# EAGLE design H00R80 (EAGLE 9.3.0)
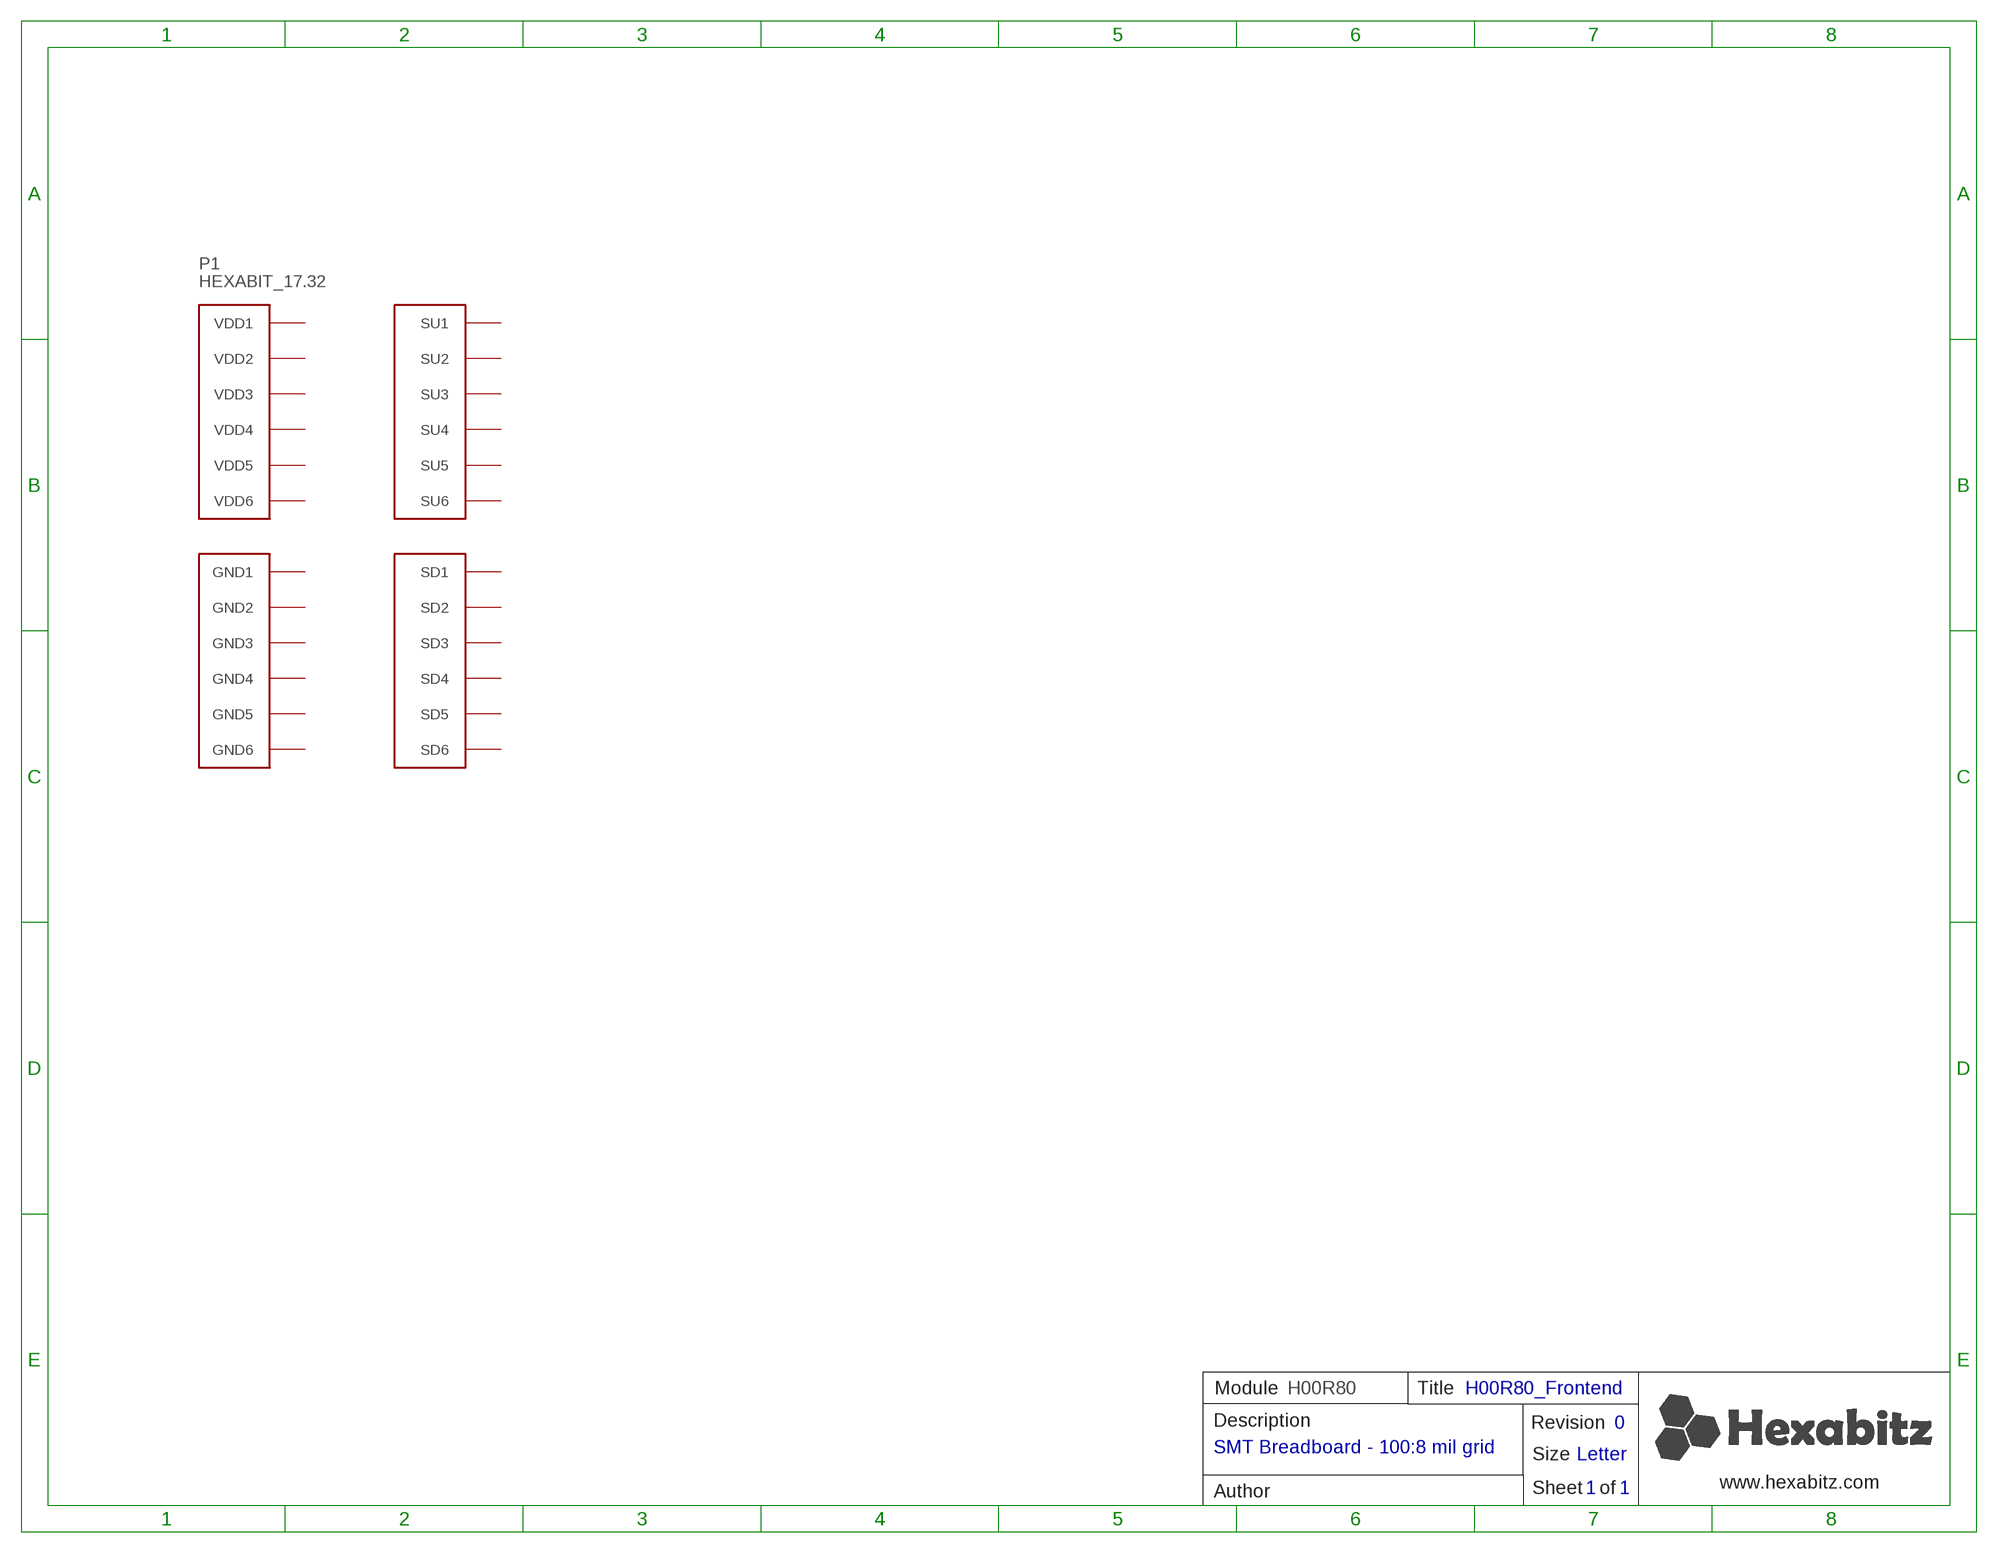
[diagram p0: schematic, sheet 1]

## Parts
P1  HEXABIT_17.32  [HEXABIT_17.32]
Unconnected: P1.PAD_PD1(SD1) P1.PAD_PD2(SD2) P1.PAD_PD3(SD3) P1.PAD_PD4(SD4) P1.PAD_PD5(SD5) P1.PAD_PD6(SD6) P1.PAD_PU1(SU1) P1.PAD_PU2(SU2) P1.PAD_PU3(SU3) P1.PAD_PU4(SU4) P1.PAD_PU5(SU5) P1.PAD_PU6(SU6)

## Notes on the sheet
- Module | H00R80 | Title | H00R80_Frontend
- Description | Revision | 0
- SMT Breadboard - 100:8 mil grid
- Size | Letter
- www.hexabitz.com
- Author | Sheet   of | 1 | 1

## Power pins joined to a net without a drawn wire
GND1: P1.PAD_PD7(GND1)
GND2: P1.PAD_PD8(GND2)
GND3: P1.PAD_PD9(GND3)
GND4: P1.PAD_PD10(GND4)
GND5: P1.PAD_PD11(GND5)
GND6: P1.PAD_PD12(GND6)
VDD1: P1.PAD_PU7(VDD1)
VDD2: P1.PAD_PU8(VDD2)
VDD3: P1.PAD_PU9(VDD3)
VDD4: P1.PAD_PU10(VDD4)
VDD5: P1.PAD_PU11(VDD5)
VDD6: P1.PAD_PU12(VDD6)

## Library data of the parts
P1 = hexabitz_connectors:HEXABIT_?: Hexabitz Hexagon Module Connector Hexagon side length = 17.32mm.

## Board
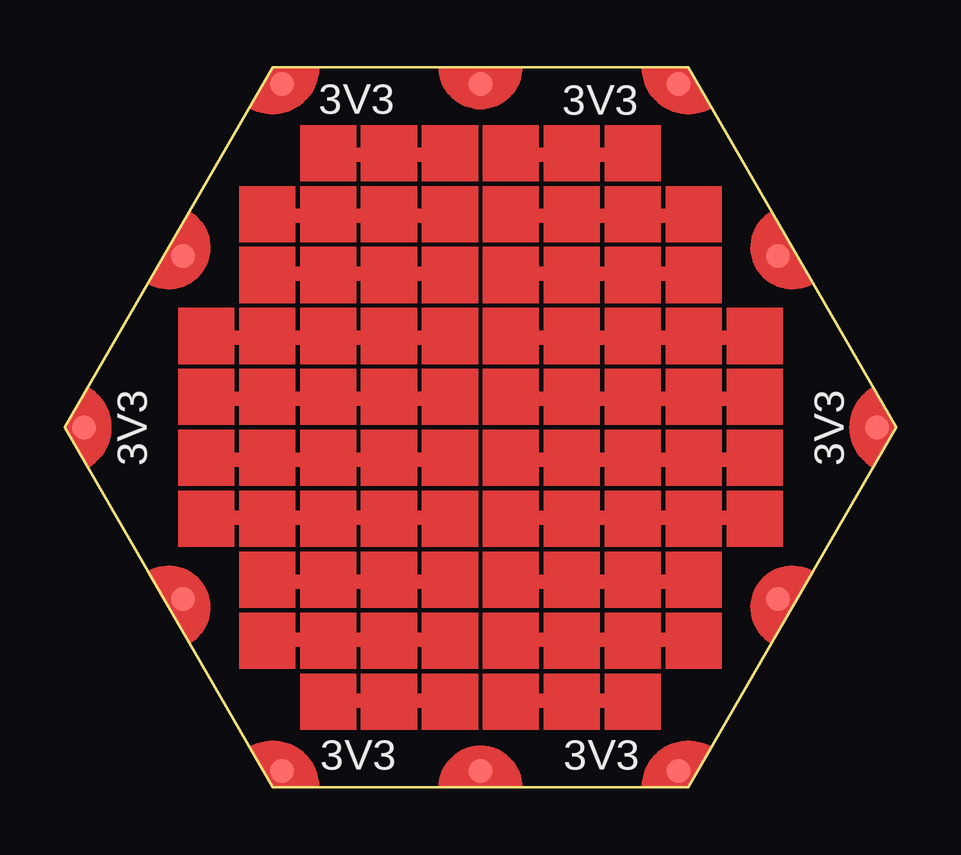
[diagram p1: board, top side]
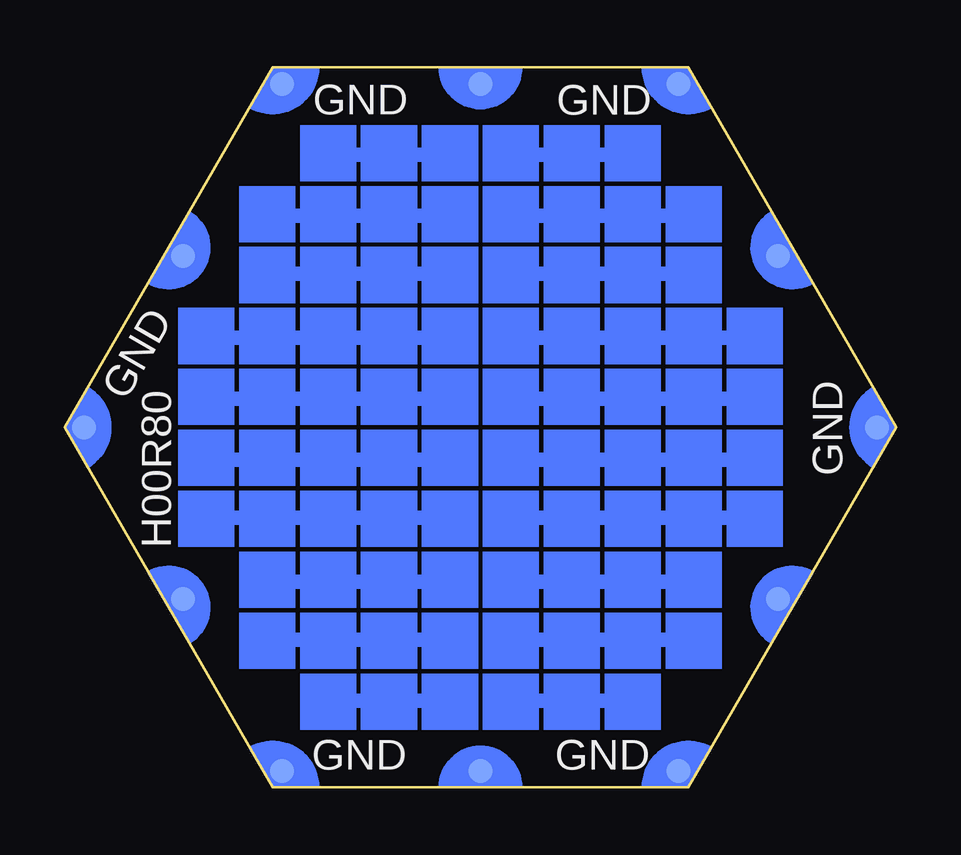
[diagram p2: board, bottom side, seen from below]

Size 34.64 x 30 mm. Coordinates in mm from the lower left corner, seen from the top.
Copper layers (1*16): Top 0.035mm / dielectric 1.5mm / Bottom 0.035mm
Design rules "2_layer *": minimum track width 7mil, minimum drill 10mil, track to track 6mil, track to pad 32mil, pad to pad 32mil, via to via 6mil, smd to smd 0mil, copper to edge 1mil, drill to drill 8mil, minimum pad ring 10mil, minimum via ring 8mil, stop-mask expansion 2mil, vias tented up to drill 15mil, thermal gap 10mil

### Footprints (pad centres in the part's own frame; a part is rotated, then mirrored left to right if it is on the bottom)
HEXABIT_17.32 = smd 1 x 1 bottom: PAD_PD1 12.39,7.15; PAD_PD2 12.39,-7.15; PAD_PD3 0,-14.31; PAD_PD4 -12.39,-7.15; PAD_PD5 -12.39,7.15; PAD_PD6 0,14.31; PAD_PD7 8.26,14.31; PAD_PD8 16.52,0; PAD_PD9 8.26,-14.31; PAD_PD10 -8.26,-14.31; PAD_PD11 -16.52,0; PAD_PD12 -8.26,14.31 | smd 1 x 1: PAD_PU1 12.39,7.15; PAD_PU2 12.39,-7.15; PAD_PU3 0,-14.31; PAD_PU4 -12.39,-7.15; PAD_PU5 -12.39,7.15; PAD_PU6 0,14.31; PAD_PU7 8.26,14.31; PAD_PU8 16.52,0; PAD_PU9 8.26,-14.31; PAD_PU10 -8.26,-14.31; PAD_PU11 -16.52,0; PAD_PU12 -8.26,14.31

### Placement (x,y rotation side)
P1  17.32,15 0 top

### Tracks (layer width: path | path; a pad name or v marks a point on that pad's centre or on a via)
N$1
  Top 0.61: 23.72,26.35 18.51,26.35
N$2
  Top 0.61: 26.13,23.81 18.51,23.81
N$3
  Top 0.61: 26.26,21.4 18.51,21.4
N$4
  Top 0.61: 28.67,18.73 18.64,18.73
N$5
  Top 0.61: 28.67,16.19 18.64,16.19
N$6
  Top 0.61: 28.8,13.65 18.64,13.65
N$7
  Top 0.61: 28.93,11.24 18.64,11.24
N$8
  Top 0.61: 26.13,8.57 18.64,8.57
N$9
  Top 0.61: 26.13,6.16 18.64,6.16
N$10
  Top 0.61: 23.59,3.62 18.64,3.62
N$11
  Top 0.61: 16.23,3.62 11.27,3.62
N$12
  Top 0.61: 16.23,6.16 8.73,6.16
N$13
  Top 0.61: 16.23,8.57 8.73,8.57
N$14
  Top 0.61: 16.23,11.24 5.94,11.24
N$15
  Top 0.61: 16.1,13.65 5.94,13.65
N$16
  Top 0.61: 15.97,16.19 5.94,16.19
N$17
  Top 0.61: 15.97,18.73 5.94,18.73
N$18
  Top 0.61: 15.97,21.4 8.23,21.4
N$19
  Top 0.61: 15.97,23.81 8.35,23.81
N$20
  Top 0.61: 15.85,26.35 10.64,26.35
N$21
  Bottom 0.61: 23.72,26.35 18.51,26.35
N$22
  Bottom 0.61: 26.13,23.81 18.51,23.81
N$23
  Bottom 0.61: 26.26,21.4 18.51,21.4
N$24
  Bottom 0.61: 28.67,18.73 18.64,18.73
N$25
  Bottom 0.61: 28.67,16.19 18.64,16.19
N$26
  Bottom 0.61: 28.8,13.65 18.64,13.65
N$27
  Bottom 0.61: 28.93,11.24 18.64,11.24
N$28
  Bottom 0.61: 26.13,8.57 18.64,8.57
N$29
  Bottom 0.61: 26.13,6.16 18.64,6.16
N$30
  Bottom 0.61: 23.59,3.62 18.64,3.62
N$31
  Bottom 0.61: 16.23,3.62 11.27,3.62
N$32
  Bottom 0.61: 16.23,6.16 8.73,6.16
N$33
  Bottom 0.61: 16.23,8.57 8.73,8.57
N$34
  Bottom 0.61: 16.23,11.24 5.94,11.24
N$35
  Bottom 0.61: 16.1,13.65 5.94,13.65
N$36
  Bottom 0.61: 15.97,16.19 5.94,16.19
N$37
  Bottom 0.61: 15.97,18.73 5.94,18.73
N$38
  Bottom 0.61: 15.97,21.4 8.23,21.4
N$39
  Bottom 0.61: 15.97,23.81 8.35,23.81
N$40
  Bottom 0.61: 15.85,26.35 10.64,26.35
(copper drawn outside any net)
  shapes: Bottom area x84, Top area x84

### Text on the board
tPlace: 3V3 | 3V3 | 3V3 | 3V3 | 3V3 | 3V3
bPlace: GND | GND | GND | GND | H00R80 | GND | GND